# Altium project power_and_motor_control.PrjPcb
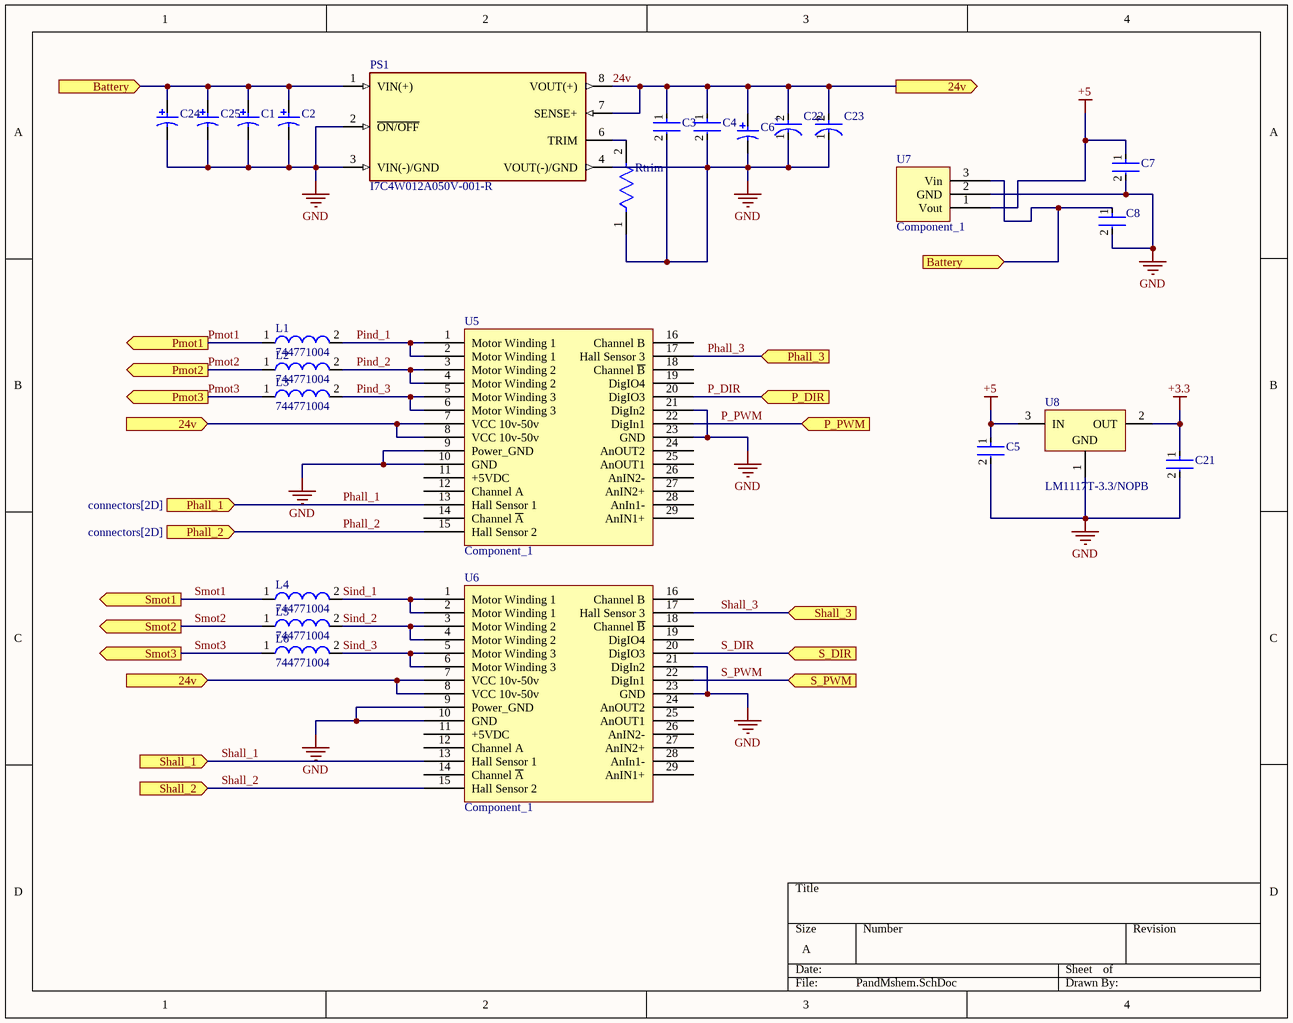
[diagram p0: PandMshem.SchDoc]
3 sheets, 74 parts. Net scope: flat (ports and power ports of the same name join across sheets).
Board file: PandMpcb.PcbDoc
Sheets:
  PandMshem.SchDoc
  Solenoid_drivers.SchDoc
  connectors.SchDoc

## Sheet PandMshem.SchDoc
size A; SheetNumber: 1; SheetTotal: 3

### Parts
C1  ECA1HM101  [CAPPR65-350-1150X800X1250]  (value not drawn)
C2  ECA1HM220  [CAPPR55-200-1100X500X1200]  (value not drawn)
C3  08055C105KAT2A  [FP-0805-L_2_01_0_2-W_1_25-MFG]  (value not drawn)
C4  C3225X7S1H106M250AB  [FP-C3225-250-0_4-IPC_C]  (value not drawn)
C5  C3225X7S1H106M250AB  [FP-C3225-250-0_4-IPC_C]  (value not drawn)
C6  ECA1HM101  [CAPPR65-350-1150X800X1250]  (value not drawn)
C7  GRM21BR61E226ME44L  [FP-GRM21B-0_2-e0_2_0_7-IPC_B]  (value not drawn)
C8  C3225X7S1H106M250AB  [FP-C3225-250-0_4-IPC_C]  (value not drawn)
C21  GRM21BR61E226ME44L  [FP-GRM21B-0_2-e0_2_0_7-IPC_B]  (value not drawn)
C22  EEUFM1V331B  [FP-RAD-TH-D_10_0_5-L_16_1-MFG]  (value not drawn)
C23  EEUFM1V331B  [FP-RAD-TH-D_10_0_5-L_16_1-MFG]  (value not drawn)
C24  ECA1HM101  [CAPPR65-350-1150X800X1250]  (value not drawn)
C25  ECA1HM101  [CAPPR65-350-1150X800X1250]  (value not drawn)
L1  744771004  [WE-PD-L]
L2  744771004  [WE-PD-L]
L3  744771004  [WE-PD-L]
L4  744771004  [WE-PD-L]
L5  744771004  [WE-PD-L]
L6  744771004  [WE-PD-L]
PS1  I7C4W012A050V-001-R  [CONV_I7C4W012A050V-001-R]
Rtrim  CRCW0805560KFKEA  [FP-CRCW0805-e3-IPC_A]  (value not drawn)
U5  Component_1  [Motor_Driver]
U6  Component_1  [Motor_Driver]
U7  Component_1  [5v_supply]
U8  LM1117T-3.3/NOPB  [NDE0003A]

### Ports
24v (in, see connectors[2B], connectors[2C], PandMshem[1B], PandMshem[3A]), 24v (in, see connectors[2B], connectors[2C], PandMshem[1C], PandMshem[3A]), 24v (out, see connectors[2B], connectors[2C], PandMshem[1B], PandMshem[1C]), Battery (in, see connectors[2B], connectors[3A], PandMshem[1A], Solenoid_drivers[1B], Solenoid_drivers[1C], Solenoid_drivers[1D], Solenoid_drivers[2A]), Battery (in, see connectors[2B], connectors[3A], PandMshem[3B], Solenoid_drivers[1B], Solenoid_drivers[1C], Solenoid_drivers[1D], Solenoid_drivers[2A]), P_DIR (in, see connectors[2A]), P_PWM (in, see connectors[2A]), Phall_1 (in, see connectors[2D]), Phall_2 (in, see connectors[2D]), Phall_3 (in, see connectors[2D]), Pmot1 (out, see connectors[4A]), Pmot2 (out, see connectors[4A]), Pmot3 (out, see connectors[3B]), S_DIR (in, see connectors[3A]), S_PWM (in, see connectors[3A]), Shall_1 (in, see connectors[3C]), Shall_2 (in, see connectors[3D]), Shall_3 (in, see connectors[3D]), Smot1 (out, see connectors[4B]), Smot2 (out, see connectors[3B]), Smot3 (out, see connectors[4C])

### Nets
+3.3: C21.1 U8.2(OUT)
+5: C5.1 C7.1 U7.1(Vout) U8.3(IN)
GND: C1.2 C2.2 C3.2 C4.2 C5.2 C6.2 C7.2 C8.2 C21.2 C22.1(C) C23.1(C) C24.2 C25.2 PS1.2(~{ON/OFF}) PS1.3(VIN(-)/GND) PS1.4(VOUT(-)/GND) Rtrim.1 U5.9(Power_GND) U5.10(GND) U5.21(DigIn2) U5.23(GND) U6.9(Power_GND) U6.10(GND) U6.21(DigIn2) U6.23(GND) U7.2(GND) U8.1(GND)
24v: C3.1 C4.1 C6.1 C22.2(A) C23.2(A) PS1.7(SENSE+) PS1.8(VOUT(+)) U5.7(VCC_10v-50v) U5.8(VCC_10v-50v) U6.7(VCC_10v-50v) U6.8(VCC_10v-50v) ; port 24v
Battery: C1.1 C2.1 C8.1 C24.1 C25.1 PS1.1(VIN(+)) U7.3(Vin) ; port Battery
P_DIR: U5.20(DigIO3) ; port P_DIR
P_PWM: U5.22(DigIn1) ; port P_PWM
Phall_1: U5.13(Hall_Sensor_1) ; port Phall_1
Phall_2: U5.15(Hall_Sensor_2) ; port Phall_2
Phall_3: U5.17(Hall_Sensor_3) ; port Phall_3
Pind_1: L1.2 U5.1(Motor_Winding_1) U5.2(Motor_Winding_1)
Pind_2: L2.2 U5.3(Motor_Winding_2) U5.4(Motor_Winding_2)
Pind_3: L3.2 U5.5(Motor_Winding_3) U5.6(Motor_Winding_3)
Pmot1: L1.1 ; port Pmot1
Pmot2: L2.1 ; port Pmot2
Pmot3: L3.1 ; port Pmot3
S_DIR: U6.20(DigIO3) ; port S_DIR
S_PWM: U6.22(DigIn1) ; port S_PWM
Shall_1: U6.13(Hall_Sensor_1) ; port Shall_1
Shall_2: U6.15(Hall_Sensor_2) ; port Shall_2
Shall_3: U6.17(Hall_Sensor_3) ; port Shall_3
Sind_1: L4.2 U6.1(Motor_Winding_1) U6.2(Motor_Winding_1)
Sind_2: L5.2 U6.3(Motor_Winding_2) U6.4(Motor_Winding_2)
Sind_3: L6.2 U6.5(Motor_Winding_3) U6.6(Motor_Winding_3)
Smot1: L4.1 ; port Smot1
Smot2: L5.1 ; port Smot2
Smot3: L6.1 ; port Smot3
NetPS1_6: PS1.6(TRIM) Rtrim.2

Not connected (* = marked no-connect by the designer): U5 11(+5VDC) 12(Channel_A) 14(Channel_~{A}) 16(Channel_B) 18(Channel_~{B}) 19(DigIO4) 24(AnOUT2) 25(AnOUT1) 26(AnIN2-) 27(AnIN2+) 28(AnIn1-) 29(AnIN1+); U6 11(+5VDC) 12(Channel_A) 14(Channel_~{A}) 16(Channel_B) 18(Channel_~{B}) 19(DigIO4) 24(AnOUT2) 25(AnOUT1) 26(AnIN2-) 27(AnIN2+) 28(AnIn1-) 29(AnIN1+)

### Notes on the sheet
- (in symbol CMP-05427-002072-1) +

### Library data of the parts
C1 C6 C24 C25 = CMP-1665-00042-2: Aluminum Electrolytic Capacitor, 100 uF, +/- 20%, 50 V, -40 to 85 degC, 2-Pin THD, RoHS, Bulk; Manufacturer: Panasonic; Lead Diameter: 0.6mm; Dielectric Material: Aluminium; Voltage Rating (DC): 50V; Ripple Current (AC): 250mA; Polarity: Polar; Leakage Current: 3uA; Capacitance: 100uF; Life (Hours): 2000Hour; Lead/Base Style: Straight; Dissipation Factor: 0.12%; Radiation Hardening: No; Height: 11.5mm; Package Quantity: 200; Package Reference: CAPPR65-350-1150X800X1250; Min Operating Temperature: -40degC; Mount: ThroughHole; Package Description: 2-Pin Radial Lead, Dia 8 mm, Height 12.5 mm; Case/Package: Radial; Diameter: 8mm; Voltage Rating: 50V; Length: 11.5mm; REACH SVHC: NoSVHC; Height - Seated (Max): 0.492inch; Datasheet URL: https://industrial.panasonic.com/cdbs/www-data/pdf/RDF0000/ABA0000C1218.pdf; RoHSCompliant: true; Ripple Current: 250mA; Lead Free: LeadFree; Voltage: 50V; Manufacturer URL: http://www.panasonic.com/; Number of Pins: 2; Datasheet Version: Rev. 05, 10/2016; Packaging: Bulk; Termination: Radial; Max Operating Temperature: 85degC; Tolerance: 20%; Lead Pitch: 3.5mm
C2 = CMP-1665-00036-2: Aluminum Electrolytic Capacitor, 22 uF, +/- 20%, 50 V, -40 to 85 degC, 2-Pin THD, RoHS, Bulk; Manufacturer: Panasonic; Ripple Current: 100mA; Life (Hours): 2000Hour; Voltage: 50V; Dissipation Factor: 0.12%; Leakage Current: 3uA; Lead/Base Style: Straight; Capacitance: 22uF; Lead Diameter: 0.5mm; Max Operating Temperature: 85degC; Height: 11mm; Package Reference: CAPPR55-200-1100X500X1200; Radiation Hardening: No; RoHSCompliant: true; Termination: Radial; Case/Package: Radial; REACH SVHC: NoSVHC; Height - Seated (Max): 0.472inch; Min Operating Temperature: -40degC; Packaging: Bulk; Manufacturer URL: http://www.panasonic.com/; Length: 11mm; Tolerance: 20%; Voltage Rating: 50V; Voltage Rating (DC): 50V; Datasheet URL: https://industrial.panasonic.com/cdbs/www-data/pdf/RDF0000/ABA0000C1218.pdf; Lead Pitch: 2mm; Ripple Current (AC): 100mA; Package Description: 2-Pin Radial Lead, Dia 5 mm, Height 12 mm; Diameter: 5mm; Datasheet Version: Rev. 05, 10/2016; Package Quantity: 200; Mount: ThroughHole
C3 = CMP-2007-04696-2: General Purpose Ceramic Capacitor, 0805, 1uF, 10%, X7R, 15%, 50V; Dissipation Factor: 2.5%; Packaging: Tape and Reel; Lead Free: Lead Free; Contact Plating: Tin; Dielectric: X7R; Tolerance: 10%; Capacitance: 1uF; REACH SVHC: No SVHC; Voltage Rating (DC): 50V; Depth: 1.25mm; Voltage Rating: 50V; Radiation Hardening: No; Case Code (Metric): 2012; Width: 0.049inch; Package Quantity: 1; Mount: Surface Mount; Length: 2.01mm; Series: -; Thickness: 0.037inch; Max Operating Temperature: 125°C; RoHS Compliant: Yes; Termination: SMD/SMT; Case/Package: 0805; Min Operating Temperature: -55°C; Voltage: 50V; Case Code (Imperial): 0805
C4 C5 C8 = CMP-08246-003772-1: Multilayer Ceramic Capacitors 10uF ±20% 50V X7S SMD 1210; Package Quantity: 1; Depth: 2.5mm; Dielectric: X7S; Radiation Hardening: No; Max Operating Temperature: 125°C; REACH SVHC: No SVHC; Thickness: 0.11inch; Voltage Rating: 50V; Length: 3.2mm; Case/Package: 1210; Min Operating Temperature: -55°C; Weight: 0.000564oz; Capacitance: 10uF; RoHS Compliant: Yes; Number of Pins: 2; Height: 2.5mm; Dielectric Material: Ceramic; Voltage: 50V; Lead Free: Lead Free; Case Code (Imperial): 1210; Packaging: Tape and Reel; Case Code (Metric): 3225; Mount: Surface Mount; Tolerance: 20%; Width: 0.098inch; Resistor Type: Ceramic; Termination: SMD/SMT; Voltage Rating (DC): 50V
C7 C21 = CMP-2007-03222-3: Chip Multilayer Ceramic Capacitors for General Purpose, 0805, 22uF, X5R, 15%, 20%, 25V; Case/Package: 0805; Depth: 1.25mm; Resistor Type: Ceramic; Voltage Rating: 25V; Lead Free: Lead Free; Voltage Rating (DC): 25V; Case Code (Metric): 2012; Thickness: 0.057inch; REACH SVHC: No SVHC; Material: Ceramic; Tolerance: 20%; Length: 2mm; Capacitance: 22uF; Case Code (Imperial): 0805; Max Operating Temperature: 85°C; Termination: SMD/SMT; Weight: 0.000335oz; Dielectric: X5R; Packaging: Tape and Reel; Voltage: 25V; Package Quantity: 3000; Height: 1.25mm; Mount: Surface Mount; Width: 1.25mm; Min Operating Temperature: -55°C
C22 C23 = CMP-05427-002072-1: Aluminum Electrolytic Capacitors (Radial Lead Type) 330uF ±20% 35V; ESR (Equivalent Series Resistance): 26mR; Life (Hours): 4000Hour; Ripple Current: 1.79A; Polarity: Polar; Lead Diameter: 0.6mm; Length: 16mm; Min Operating Temperature: -40°C; Package Quantity: 1000; Diameter: 10mm; Series: FM; RoHS Compliant: Yes; Lead Free: Lead Free; Tolerance: 20%; Voltage Rating (DC): 35V; Termination: Radial; Packaging: Tape and Reel; Contact Plating: Tin; Case/Package: Radial; Height: 16mm; Mount: Through Hole; Max Operating Temperature: 105°C; Impedance: 26mR; Capacitance: 330uF; Lead Pitch: 5mm; Radiation Hardening: No; Voltage Rating: 35V; Height - Seated (Max): 0.688inch
L1-L6 = CMP-0227-00698-1: SMD-Shielded Power Inductor WE-PD, L = 4.70 µH; Inductance: 4.70 ÂµH; ComponentLink1Description: Manufacturer Link; ComponentLink2Description: Datasheet; ComponentLink2URL: http://www.we-online.de/katalog/media/pdf/744771004.pdf; PackageReference: WE-PD-L; ComponentLink1URL: http://www.we-online.com; DatasheetVersion: ver 7, Sep-2006; PackageDescription: SMD Inductor, 2-Leads, Body 12.0 x 12.0 mm; PackageVersion: 2006
PS1 = I7C4W012A050V-001-R: Non-Isolated PoL Module DC DC Converter 1 Output 5 ~ 28V - - - 12.5A 9V - 53V Input; MF: TDK-Lambda Americas Inc; Value: *; Check_prices: https://www.snapeda.com/parts/I7C4W012A050V-001-R/TDK-Lambda+Americas+Inc/view-part/?ref=eda; MP: I7C4W012A050V-001-R; Price: None; Purchase-URL: https://pricing.snapeda.com/search/part/I7C4W012A050V-001-R/?ref=eda; Availability: In Stock; Package: Sixteenth Brick TDK-Lambda Americas Inc.; SnapEDA_Link: https://www.snapeda.com/parts/I7C4W012A050V-001-R/TDK-Lambda+Americas+Inc/view-part/?ref=snap
Rtrim = CMP-2001-04009-2: RES Thick Film, 560kΩ, 1%, 0.125W, 100ppm/°C, 0805; Max Power Dissipation: 125mW; Voltage Rating (DC): 150V; Resistance: 560kR; Temperature Coefficient: 100ppm/°C; Contact Plating: Tin; Case/Package: 0805; Power Rating: 125mW; Lead Free: Lead Free; Case Code (Metric): 2012; Case Code (Imperial): 0805; Termination: SMD/SMT; Width: 0.049inch; Features: Automotive AEC-Q200; Weight: 0.000194oz; Max Operating Temperature: 155°C; Number of Terminations: 2; Length: 2mm; Military Standard: Not; Package Quantity: 10; Tolerance: 1%; Radiation Hardening: No; Composition: Thick Film; Height: 0.45mm; Min Operating Temperature: -55°C; Packaging: Tape and Reel; Voltage Rating: 150V; Depth: 1.25mm
U8 = CMP-0062-02494-3: 800mA Low-Dropout Linear Regulator, 3-pin TO-220, Pb-Free; Manufacturer: Texas Instruments; PackageTopMarking: NSUZXYTTE#*LM1117T*3.3; PowerWise: N; CompType: LDO IC; RoHS: Y; ComponentLink1URL: http://www.ti.com/general/docs/lit/getliterature.tsp?genericPartNumber=LM1117-N&fileType=pdf; PackageReference: NDE0003A; PinCount: 3; ComponentLink1Description: Datasheet URL; PackageDescription: TO-220, Molded, 3 Lead, Straight

## Sheet Solenoid_drivers.SchDoc
size A; SheetNumber: 2; SheetTotal: 3
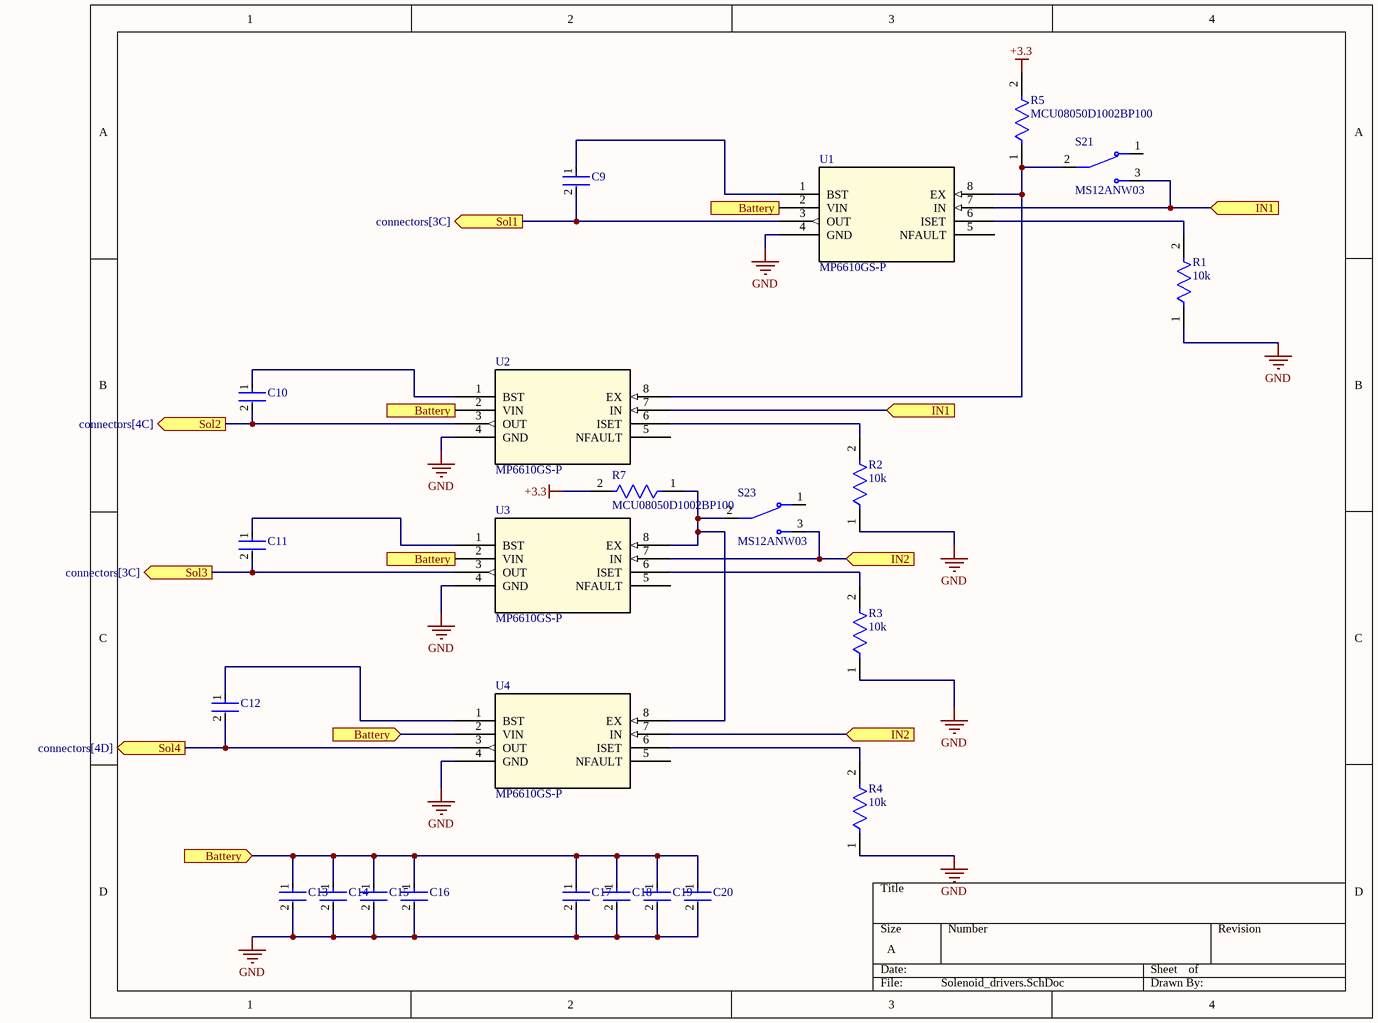
[diagram p1: Solenoid_drivers.SchDoc]

### Parts
C9  C0805C104K5RACTU  [FP-C0805C-DN-MFG]  (value not drawn)
C10  C0805C104K5RACTU  [FP-C0805C-DN-MFG]  (value not drawn)
C11  C0805C104K5RACTU  [FP-C0805C-DN-MFG]  (value not drawn)
C12  C0805C104K5RACTU  [FP-C0805C-DN-MFG]  (value not drawn)
C13  C0805C104K5RACTU  [FP-C0805C-DN-MFG]  (value not drawn)
C14  C0805C104K5RACTU  [FP-C0805C-DN-MFG]  (value not drawn)
C15  C0805C104K5RACTU  [FP-C0805C-DN-MFG]  (value not drawn)
C16  C0805C104K5RACTU  [FP-C0805C-DN-MFG]  (value not drawn)
C17  GRM21BR6YA106ME43L  [FP-GRM21B-0_2-e0_2_0_7-IPC_B]  (value not drawn)
C18  GRM21BR6YA106ME43L  [FP-GRM21B-0_2-e0_2_0_7-IPC_B]  (value not drawn)
C19  GRM21BR6YA106ME43L  [FP-GRM21B-0_2-e0_2_0_7-IPC_B]  (value not drawn)
C20  GRM21BR6YA106ME43L  [FP-GRM21B-0_2-e0_2_0_7-IPC_B]  (value not drawn)
R1  10k  [FP-MCU0805-IPC_C]
R2  10k  [FP-MCU0805-IPC_C]
R3  10k  [FP-MCU0805-IPC_C]
R4  10k  [FP-MCU0805-IPC_C]
R5  MCU08050D1002BP100  [FP-MCU0805-IPC_C]
R7  MCU08050D1002BP100  [FP-MCU0805-IPC_C]
S21  MS12ANW03  [SW_MS12ANW03]
S23  MS12ANW03  [SW_MS12ANW03]
U1  MP6610GS-P  [SOIC-8_MP6610_MNP]
U2  MP6610GS-P  [SOIC-8_MP6610_MNP]
U3  MP6610GS-P  [SOIC-8_MP6610_MNP]
U4  MP6610GS-P  [SOIC-8_MP6610_MNP]

### Ports
Battery (in, see connectors[2B], connectors[3A], PandMshem[1A], PandMshem[3B], Solenoid_drivers[1B], Solenoid_drivers[1C], Solenoid_drivers[1D]), Battery (in, see connectors[2B], connectors[3A], PandMshem[1A], PandMshem[3B], Solenoid_drivers[1B], Solenoid_drivers[1C], Solenoid_drivers[1D], Solenoid_drivers[2A]), Battery (in, see connectors[2B], connectors[3A], PandMshem[1A], PandMshem[3B], Solenoid_drivers[1B], Solenoid_drivers[1C], Solenoid_drivers[2A]), Battery (in, see connectors[2B], connectors[3A], PandMshem[1A], PandMshem[3B], Solenoid_drivers[1C], Solenoid_drivers[1D], Solenoid_drivers[2A]), IN1 (in, see connectors[1A], Solenoid_drivers[3B]), IN1 (in, see connectors[1A], Solenoid_drivers[4A]), IN2 (in, see connectors[1A], Solenoid_drivers[3C]), Sol1 (out, see connectors[3C]), Sol2 (out, see connectors[4C]), Sol3 (out, see connectors[3C]), Sol4 (out, see connectors[4D])

### Nets
+3.3: R5.2 R7.2
GND: C13.2 C14.2 C15.2 C16.2 C17.2 C18.2 C19.2 C20.2 R1.1 R2.1 R3.1 R4.1 U1.4(GND) U2.4(GND) U3.4(GND) U4.4(GND)
Battery: C13.1 C14.1 C15.1 C16.1 C17.1 C18.1 C19.1 C20.1 U1.2(VIN) U2.2(VIN) U3.2(VIN) U4.2(VIN) ; port Battery
IN1: S21.3 U1.7(IN) U2.7(IN) ; port IN1
IN2: S23.3 U3.7(IN) U4.7(IN) ; port IN2
Sol1: C9.2 U1.3(OUT) ; port Sol1
Sol2: C10.2 U2.3(OUT) ; port Sol2
Sol3: C11.2 U3.3(OUT) ; port Sol3
Sol4: C12.2 U4.3(OUT) ; port Sol4
NetC9_1: C9.1 U1.1(BST)
NetC10_1: C10.1 U2.1(BST)
NetC11_1: C11.1 U3.1(BST)
NetC12_1: C12.1 U4.1(BST)
NetR1_2: R1.2 U1.6(ISET)
NetR2_2: R2.2 U2.6(ISET)
NetR3_2: R3.2 U3.6(ISET)
NetR4_2: R4.2 U4.6(ISET)
NetR5_1: R5.1 S21.2 U1.8(EX) U2.8(EX)
NetR7_1: R7.1 S23.2 U3.8(EX) U4.8(EX)

Not connected (* = marked no-connect by the designer): S21 1; S23 1; U1 5(NFAULT); U2 5(NFAULT); U3 5(NFAULT); U4 5(NFAULT)

### Library data of the parts
C9-C11 C13-C16 = CMP-2007-00279-2: CAP CER 0.1UF 50V X7R 0805; Manufacturer: KEMET; Value: 0.10 μF; Tolerance: 0.1; Temperature Coefficient: 30ppm/°C; Material: Ceramic; Manufacturer Part Number: C0805C104K5RACTU; Device Class L2: Capacitors; Temperature Range Low: -55°C; Voltage Rating: 50 V; Digikey Description: CAP CER 0.1UF 50V X7R 0805; Category: Cap; ComponentLink2Description: Datasheet; Octopart: https://octopart.com/c0805c104k5ractu-kemet-143926; RoHS: TRUE; ComponentLink2URL: https://content.kemet.com/datasheets/KEM_C1003_C0G_SMD.pdf; Temperature Characteristic: X7R; Temperature: -55°C to +125°C; Height: 0.88mm; Temperature Range High: +125°C; Device Class L1: Passive Components; Automotive: No; Lead Free: Yes; Ipc Land Pattern Name: CAPC200125X78; Device Class L3: Ceramic Capacitors; Mouser Description: Cap Ceramic 0.1uF 50V X7R 10% SMD 2.0 x 1.2 mm 125 C Paper T/R; Capacitance: 0.10 μF; Package: C0805C-DN
C12 = CMP-2007-00279-2: CAP CER 0.1UF 50V X7R 0805 C0805C104K5RACTU; Manufacturer: KEMET; Value: 0.10 μF; Tolerance: 0.1; Temperature Coefficient: 30ppm/°C; Material: Ceramic; Manufacturer Part Number: C0805C104K5RACTU; Device Class L2: Capacitors; Temperature Range Low: -55°C; Voltage Rating: 50 V; Digikey Description: CAP CER 0.1UF 50V X7R 0805; Category: Cap; ComponentLink2Description: Datasheet; Octopart: https://octopart.com/c0805c104k5ractu-kemet-143926; RoHS: TRUE; ComponentLink2URL: https://content.kemet.com/datasheets/KEM_C1003_C0G_SMD.pdf; Temperature Characteristic: X7R; Temperature: -55°C to +125°C; Height: 0.88mm; Temperature Range High: +125°C; Device Class L1: Passive Components; Automotive: No; Lead Free: Yes; Ipc Land Pattern Name: CAPC200125X78; Device Class L3: Ceramic Capacitors; Mouser Description: Cap Ceramic 0.1uF 50V X7R 10% SMD 2.0 x 1.2 mm 125 C Paper T/R; Capacitance: 0.10 μF; Package: C0805C-DN
C17-C20 = CMP-06035-010759-1: Chip Multilayer Ceramic Capacitors for General Purpose, 0805, 10uF, X5R, 15%, 20%, 35V; Length: 0.079inch; Packaging: Tape and Reel; Weight: 0.000335oz; Height: 1.25mm; Max Operating Temperature: 85°C; Thickness: 0.057inch; Case Code (Metric): 2012; Voltage Rating: 35V; Voltage Rating (DC): 35V; Mount: Surface Mount; Case Code (Imperial): 0805; Width: 0.049inch; Package Quantity: 3000; Tolerance: 20%; Capacitance: 10uF; Min Operating Temperature: -55°C; Case/Package: 0805; Termination: SMD/SMT; Dielectric: X5R
R1-R4 = CMP-02407-010458-1: RES 1.05K OHM 0.5% 1/5W 0805   MCU08050D1002BP100; Power Rating: 125mW; Voltage Rating (DC): 100V; Tolerance: 0.1%; Resistance: 10kR; Temperature Coefficient: 25ppm/°C; Min Operating Temperature: -55°C; Military Standard: Not; Composition: Thin Film; Max Power Dissipation: 125mW; Lead Free: Lead Free; Case/Package: 0805; Contact Plating: Tin; Depth: 1.25mm; Number of Terminations: 2; Height: 0.022inch; Package Quantity: 1000; Max Operating Temperature: 125°C; Packaging: Tape and Reel; Mount: Surface Mount; Radiation Hardening: No; Length: 2mm; Width: 0.049inch
R5 R7 = CMP-02407-010458-1: RES 1.05K OHM 0.5% 1/5W 0805; Power Rating: 125mW; Voltage Rating (DC): 100V; Tolerance: 0.1%; Resistance: 10kR; Temperature Coefficient: 25ppm/°C; Min Operating Temperature: -55°C; Military Standard: Not; Composition: Thin Film; Max Power Dissipation: 125mW; Lead Free: Lead Free; Case/Package: 0805; Contact Plating: Tin; Depth: 1.25mm; Number of Terminations: 2; Height: 0.022inch; Package Quantity: 1000; Max Operating Temperature: 125°C; Packaging: Tape and Reel; Mount: Surface Mount; Radiation Hardening: No; Length: 2mm; Width: 0.049inch
S21 S23 = MS12ANW03: Slide Switch SPDT Through Hole; MF: NKK Switches; Package: None; MP: MS12ANW03; Value: *; Availability: Unavailable; SnapEDA_Link: https://www.snapeda.com/parts/MS12ANW03/NKK%20Switches/view-part/489520/?ref=snap; Price: None
U1-U4 = MP6610GS-P: No Description Available; Mfr_Name: Monolithic Power Systems; RefDes: RefDes; Type: Type

## Sheet connectors.SchDoc
size A; SheetNumber: 3; SheetTotal: 3
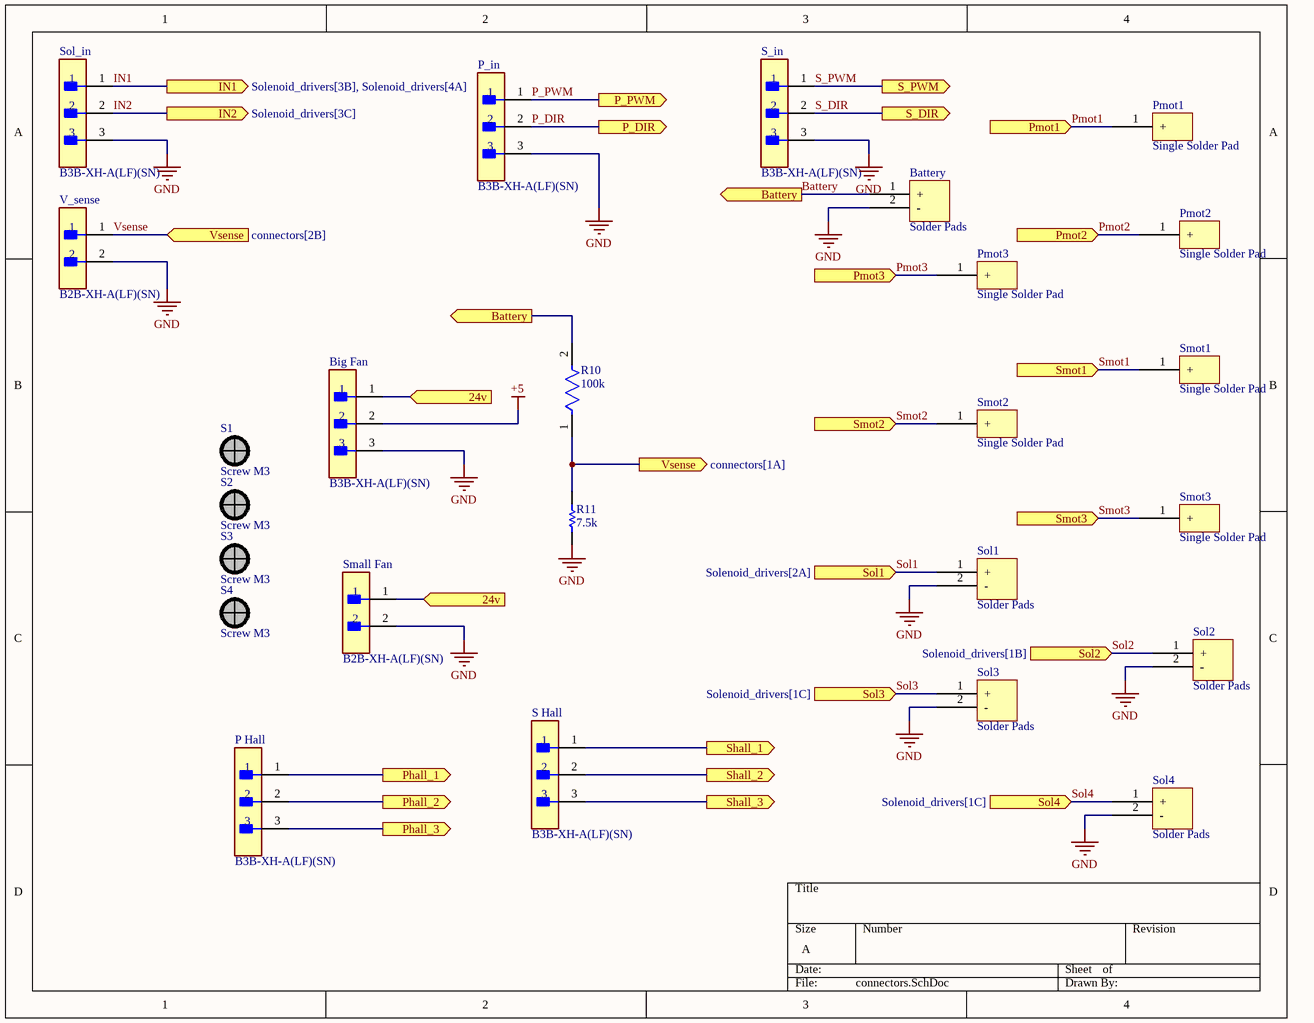
[diagram p2: connectors.SchDoc]

### Parts
Battery  Solder Pads  [Solder Pad]
Big_Fan  B3B-XH-A(LF)(SN)  [FP-B3B-XH-A_LF_SN-MFG]
P_Hall  B3B-XH-A(LF)(SN)  [FP-B3B-XH-A_LF_SN-MFG]
P_in  B3B-XH-A(LF)(SN)  [FP-B3B-XH-A_LF_SN-MFG]
Pmot1  Single Solder Pad  [SOLDER PAD SINGLE]
Pmot2  Single Solder Pad  [SOLDER PAD SINGLE]
Pmot3  Single Solder Pad  [SOLDER PAD SINGLE]
R10  100k  [FP-CR0805-MFG]
R11  7.5k  [RESC2013X70X40LL20T20]
S1  Screw M3  [Screw M3]
S2  Screw M3  [Screw M3]
S3  Screw M3  [Screw M3]
S4  Screw M3  [Screw M3]
S_Hall  B3B-XH-A(LF)(SN)  [FP-B3B-XH-A_LF_SN-MFG]
S_in  B3B-XH-A(LF)(SN)  [FP-B3B-XH-A_LF_SN-MFG]
Small_Fan  B2B-XH-A(LF)(SN)  [FP-B2B-XH-A_LF_SN-MFG]
Smot1  Single Solder Pad  [SOLDER PAD SINGLE]
Smot2  Single Solder Pad  [SOLDER PAD SINGLE]
Smot3  Single Solder Pad  [SOLDER PAD SINGLE]
Sol1  Solder Pads  [Solder Pad]
Sol2  Solder Pads  [Solder Pad]
Sol3  Solder Pads  [Solder Pad]
Sol4  Solder Pads  [Solder Pad]
Sol_in  B3B-XH-A(LF)(SN)  [FP-B3B-XH-A_LF_SN-MFG]
V_sense  B2B-XH-A(LF)(SN)  [FP-B2B-XH-A_LF_SN-MFG]

### Ports
24v (in, see connectors[2B], PandMshem[1B], PandMshem[1C], PandMshem[3A]), 24v (in, see connectors[2C], PandMshem[1B], PandMshem[1C], PandMshem[3A]), Battery (out, see connectors[2B], PandMshem[1A], PandMshem[3B], Solenoid_drivers[1B], Solenoid_drivers[1C], Solenoid_drivers[1D], Solenoid_drivers[2A]), Battery (out, see connectors[3A], PandMshem[1A], PandMshem[3B], Solenoid_drivers[1B], Solenoid_drivers[1C], Solenoid_drivers[1D], Solenoid_drivers[2A]), IN1 (out, see Solenoid_drivers[3B], Solenoid_drivers[4A]), IN2 (out, see Solenoid_drivers[3C]), P_DIR (out, see PandMshem[3B]), P_PWM (out, see PandMshem[3B]), Phall_1 (out, see PandMshem[1B]), Phall_2 (out, see PandMshem[1C]), Phall_3 (out, see PandMshem[3B]), Pmot1 (in, see PandMshem[1B]), Pmot2 (in, see PandMshem[1B]), Pmot3 (in, see PandMshem[1B]), S_DIR (out, see PandMshem[3C]), S_PWM (out, see PandMshem[3C]), Shall_1 (out, see PandMshem[1C]), Shall_2 (out, see PandMshem[1D]), Shall_3 (out, see PandMshem[3C]), Smot1 (in, see PandMshem[1C]), Smot2 (in, see PandMshem[1C]), Smot3 (in, see PandMshem[1C]), Sol1 (in, see Solenoid_drivers[2A]), Sol2 (in, see Solenoid_drivers[1B]), Sol3 (in, see Solenoid_drivers[1C]), Sol4 (in, see Solenoid_drivers[1C]), Vsense (in, see connectors[2B]), Vsense (out, see connectors[1A])

### Nets
+5: Big_Fan.2
GND: Battery.2(-) Big_Fan.3 P_in.3 R11.1 S_in.3 Small_Fan.2 Sol1.2(-) Sol2.2(-) Sol3.2(-) Sol4.2(-) Sol_in.3 V_sense.2
24v: Big_Fan.1 Small_Fan.1 ; port 24v
Battery: Battery.1(+) R10.2 ; port Battery
IN1: Sol_in.1 ; port IN1
IN2: Sol_in.2 ; port IN2
P_DIR: P_in.2 ; port P_DIR
P_PWM: P_in.1 ; port P_PWM
Phall_1: P_Hall.1 ; port Phall_1
Phall_2: P_Hall.2 ; port Phall_2
Phall_3: P_Hall.3 ; port Phall_3
Pmot1: Pmot1.1(+) ; port Pmot1
Pmot2: Pmot2.1(+) ; port Pmot2
Pmot3: Pmot3.1(+) ; port Pmot3
S_DIR: S_in.2 ; port S_DIR
S_PWM: S_in.1 ; port S_PWM
Shall_1: S_Hall.1 ; port Shall_1
Shall_2: S_Hall.2 ; port Shall_2
Shall_3: S_Hall.3 ; port Shall_3
Smot1: Smot1.1(+) ; port Smot1
Smot2: Smot2.1(+) ; port Smot2
Smot3: Smot3.1(+) ; port Smot3
Sol1: Sol1.1(+) ; port Sol1
Sol2: Sol2.1(+) ; port Sol2
Sol3: Sol3.1(+) ; port Sol3
Sol4: Sol4.1(+) ; port Sol4
Vsense: R10.1 R11.2 V_sense.1 ; port Vsense

### Library data of the parts
Battery Sol1-Sol4 = Component_1
Big_Fan P_Hall P_in S_Hall S_in Sol_in = CMP-17439-000014-3: CONN HEADER VERT 3POS 2.5MM; Max Voltage Rating (DC): 250V; Number of Positions: 3; Current Rating: 3A; Gender: Male; Wire/Cable Gauge: 22AWG; Contact Resistance: 20mR; Insulation Resistance: 1GR; Insulation Material: Nylon; Contact Plating: Tin; Depth: 5.75mm; Contact Type: Male Pin; Max Operating Temperature: 85°C; Insulation Color: Natural; Voltage Rating (AC): 250V; Color: Natural; Connector Type: Header; Orientation: Straight; Fastening Type: Detent; Housing Color: White; Min Operating Temperature: -25°C; Termination: Solder; Voltage Rating: 250V; Series: XH; Pitch: 2.5mm; Contact Shape: Square; Number of Rows: 1; Lead Free: Lead Free; Packaging: Bulk; Mount: Through Hole; Flammability Rating: UL94 V-0; Max Voltage Rating (AC): 250V; REACH SVHC: No SVHC; Housing Material: Polyamide; Contact Material: Brass; Lead Pitch: 2.5mm; Contact Finish - Mating: TIN; Length: 9.9mm; Max Current Rating: 3A; Number of Contacts: 3
Pmot1-Pmot3 Smot1-Smot3 = singlesolpad_1
R10 = CMP-07231-001707-1: Thick Film Chip Resistors 0805 100kΩ 0.125W 5% 200ppm/°C CR0805-JW-104GLF; Power Rating: 125mW; Voltage Rating: 150V; Resistance: 100kR; Case Code (Metric): 2012; Case Code (Imperial): 0805; Temperature Coefficient: 200ppm/°C; Mount: Surface Mount; Tolerance: 5%; Radiation Hardening: No; Military Standard: Not; Contact Plating: Tin; Number of Terminations: 2; Packaging: Tape and Reel; Thickness: 508um; Length: 0.079inch; Depth: 1.25mm; Min Operating Temperature: -55°C; Features: Moisture Resistant; Max Operating Temperature: 155°C; Width: 0.049inch; Package Quantity: 10000; Termination: SMD/SMT; Composition: Thick Film; Max Power Dissipation: 125mW; Height: 0.024inch; Case/Package: 0805
R11 = CMP-2001-00447-1: ERJ-6GEYJ752V; Manufacturer: Panasonic; Part Number: ERJ-6GEYJ752V
Small_Fan V_sense = CMP-2000-05888-3: CONN HEADER VERT 2POS 2.5MM; Current Rating: 3A; Voltage Rating: 250V; Number of Contacts: 2; Contact Resistance: 20mR; Wire/Cable Gauge: 22AWG; Insulation Resistance: 1GR; Connector Type: Male Pin; Packaging: Bulk; Contact Material: Brass; Lead Free: Lead Free; Orientation: Straight; Contact Plating: Tin; Max Current Rating: 3A; Termination: Solder; Fastening Type: Detent; Depth: 5.75mm; Housing Material: Polyamide; REACH SVHC: No SVHC; Series: XH; Voltage Rating (AC): 250V; Number of Positions: 2; Color: Natural; Contact Type: Male Pin; Max Voltage Rating (DC): 250V; Pitch: 2.5mm; Lead Pitch: 2.5mm; Mount: Through Hole; Max Operating Temperature: 85°C; Length: 7.4mm; Max Voltage Rating (AC): 250V; Min Operating Temperature: -25°C; Number of Rows: 1; Housing Color: White

## Nets that join several sheets
+3.3: PandMshem (C21.1 U8.2), Solenoid_drivers (R5.2 R7.2)
+5: PandMshem (C5.1 C7.1 U7.1 U8.3), connectors (Big_Fan.2)
GND: PandMshem (27 pins), Solenoid_drivers (16 pins), connectors (12 pins)
24v: PandMshem (11 pins), connectors (Big_Fan.1 Small_Fan.1)
Battery: PandMshem (7 pins), Solenoid_drivers (12 pins), connectors (Battery.1 R10.2)
IN1: Solenoid_drivers (S21.3 U1.7 U2.7), connectors (Sol_in.1)
IN2: Solenoid_drivers (S23.3 U3.7 U4.7), connectors (Sol_in.2)
P_DIR: PandMshem (U5.20), connectors (P_in.2)
P_PWM: PandMshem (U5.22), connectors (P_in.1)
Phall_1: PandMshem (U5.13), connectors (P_Hall.1)
Phall_2: PandMshem (U5.15), connectors (P_Hall.2)
Phall_3: PandMshem (U5.17), connectors (P_Hall.3)
Pmot1: PandMshem (L1.1), connectors (Pmot1.1)
Pmot2: PandMshem (L2.1), connectors (Pmot2.1)
Pmot3: PandMshem (L3.1), connectors (Pmot3.1)
S_DIR: PandMshem (U6.20), connectors (S_in.2)
S_PWM: PandMshem (U6.22), connectors (S_in.1)
Shall_1: PandMshem (U6.13), connectors (S_Hall.1)
Shall_2: PandMshem (U6.15), connectors (S_Hall.2)
Shall_3: PandMshem (U6.17), connectors (S_Hall.3)
Smot1: PandMshem (L4.1), connectors (Smot1.1)
Smot2: PandMshem (L5.1), connectors (Smot2.1)
Smot3: PandMshem (L6.1), connectors (Smot3.1)
Sol1: Solenoid_drivers (C9.2 U1.3), connectors (Sol1.1)
Sol2: Solenoid_drivers (C10.2 U2.3), connectors (Sol2.1)
Sol3: Solenoid_drivers (C11.2 U3.3), connectors (Sol3.1)
Sol4: Solenoid_drivers (C12.2 U4.3), connectors (Sol4.1)